# Altium schematic sheet Button_connections.SchDoc: Digital Watch Button Schematic
size Letter; DrawnBy: Zach Haviland; DocumentNumber: 3; Revision: 1; SheetNumber: 3; SheetTotal: 4
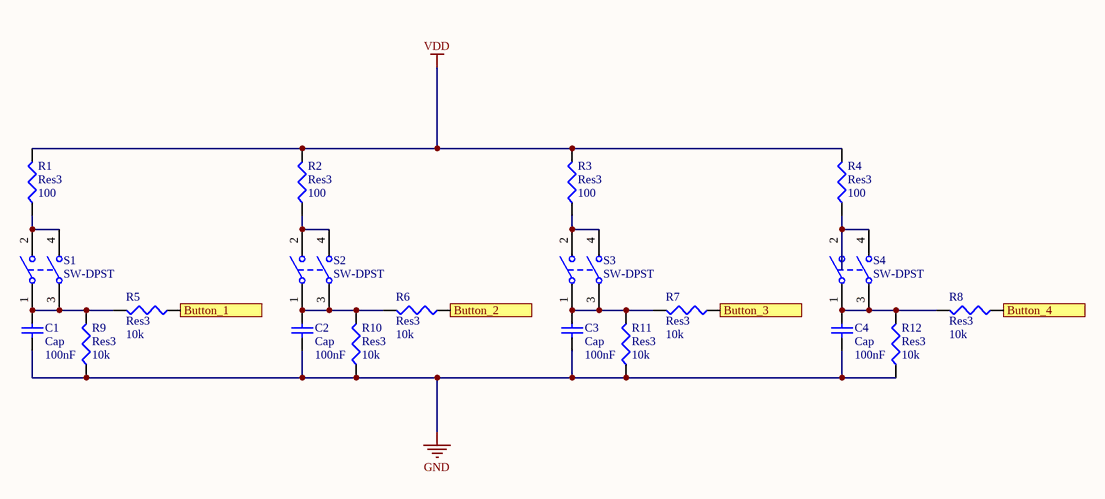
[diagram p0: Button_connections.SchDoc]

## Parts
C1  Cap  value 100nF  [C0805]
C2  Cap  value 100nF  [C0805]
C3  Cap  value 100nF  [C0805]
C4  Cap  value 100nF  [C0805]
R1  Res3  value 100  [1608[0603]]
R2  Res3  value 100  [1608[0603]]
R3  Res3  value 100  [1608[0603]]
R4  Res3  value 100  [1608[0603]]
R5  Res3  value 10k  [1608[0603]]
R6  Res3  value 10k  [1608[0603]]
R7  Res3  value 10k  [1608[0603]]
R8  Res3  value 10k  [1608[0603]]
R9  Res3  value 10k  [1608[0603]]
R10  Res3  value 10k  [1608[0603]]
R11  Res3  value 10k  [1608[0603]]
R12  Res3  value 10k  [1608[0603]]
S1  SW-DPST  [PCBComponent_1]
S2  SW-DPST  [PCBComponent_1]
S3  SW-DPST  [PCBComponent_1]
S4  SW-DPST  [PCBComponent_1]

## Ports
Button_1 (out), Button_2 (out), Button_3 (out), Button_4 (out)

## Nets
GND: C1.1 C2.1 C3.1 C4.1 R9.1 R10.1 R11.1 R12.1
VDD: R1.2 R2.2 R3.2 R4.2
Button_1: R5.1 ; port Button_1
Button_2: R6.1 ; port Button_2
Button_3: R7.1 ; port Button_3
Button_4: R8.1 ; port Button_4
NetC1_2: C1.2 R5.2 R9.2 S1.1(COMMON1) S1.3(COMMON2)
NetC2_2: C2.2 R6.2 R10.2 S2.1(COMMON1) S2.3(COMMON2)
NetC3_2: C3.2 R7.2 R11.2 S3.1(COMMON1) S3.3(COMMON2)
NetC4_2: C4.2 R8.2 R12.2 S4.1(COMMON1) S4.3(COMMON2)
NetR1_1: R1.1 S1.2(NO1) S1.4(NO2)
NetR2_1: R2.1 S2.2(NO1) S2.4(NO2)
NetR3_1: R3.1 S3.2(NO1) S3.4(NO2)
NetR4_1: R4.1 S4.2(NO1) S4.4(NO2)

## Notes on the sheet
- Debounce circuit has 2nd 10k resistor in wrong spot. Should be between button+cap node and other 10k node. Please fix before doing next PCB revision.
- Title
- Size:
- Date:
- Letter
- Number:
- Time:
- Revision:
- Sheet
- of
- File:

## Library data of the parts
C1-C4 = Cap: Capacitor; Published: 8-Jun-2000; LatestRevisionDate: 17-Jul-2002; LatestRevisionNote: Re-released for DXP Platform.; PackageReference: RAD-0.3; Publisher: Altium Limited; PackageDescription: Radial Cap, Thru-Hole; 2 Leads; 0.3 in Pin Spacing
R1-R12 = Res3: Resistor; Published: 8-Jun-2000; LatestRevisionDate: 29-May-2009; LatestRevisionNote: IPC-7351 Footprint Added.; PackageReference: J1-0603; Publisher: Altium Limited; PackageDescription: Chip Resistor
S1-S4 = SW-DPST: Double-Pole, Single-Throw Switch; Published: 24-Mar-1999; LatestRevisionDate: 17-Jul-2002; LatestRevisionNote: Re-released for DXP Platform.; PackageReference: DPST-4; Publisher: Altium Limited; PackageDescription: Switch; 4 Leads